# EAGLE schematic PixelPusher-ethernet-extender-shield (EAGLE 7.2.0)
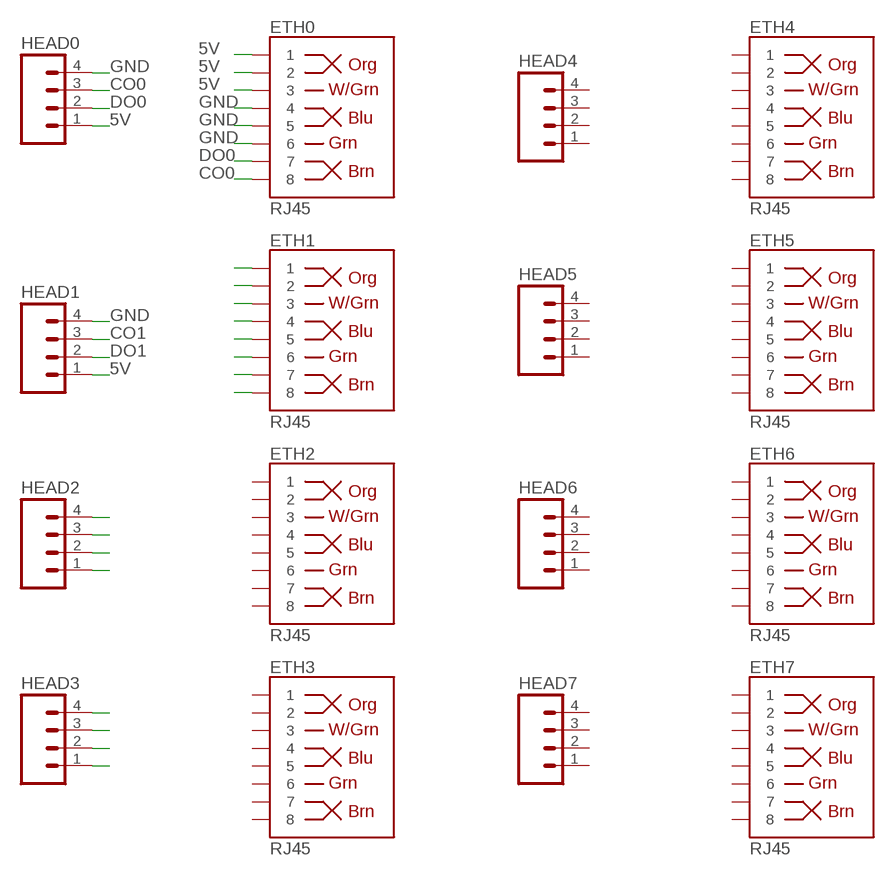
[diagram p0: schematic, sheet 1]

## Parts
ETH0  RJ45  RJ45-8PTH  [RJ45-8]
ETH1  RJ45  RJ45-8PTH  [RJ45-8]
ETH2  RJ45  RJ45-8PTH  [RJ45-8]
ETH3  RJ45  RJ45-8PTH  [RJ45-8]
ETH4  RJ45  RJ45-8PTH  [RJ45-8]
ETH5  RJ45  RJ45-8PTH  [RJ45-8]
ETH6  RJ45  RJ45-8PTH  [RJ45-8]
ETH7  RJ45  RJ45-8PTH  [RJ45-8]
HEAD0  M04JST-PTH-VERT  [JST-4-PTH-VERT]
HEAD1  M04JST-PTH-VERT  [JST-4-PTH-VERT]
HEAD2  M04JST-PTH-VERT  [JST-4-PTH-VERT]
HEAD3  M04JST-PTH-VERT  [JST-4-PTH-VERT]
HEAD4  M04JST-PTH-VERT  [JST-4-PTH-VERT]
HEAD5  M04JST-PTH-VERT  [JST-4-PTH-VERT]
HEAD6  M04JST-PTH-VERT  [JST-4-PTH-VERT]
HEAD7  M04JST-PTH-VERT  [JST-4-PTH-VERT]

## Nets
5V: ETH0.1 ETH0.2 ETH0.3 HEAD0.1 HEAD1.1
CO0: ETH0.8 HEAD0.3
CO1: HEAD1.3
DO0: ETH0.7 HEAD0.2
DO1: HEAD1.2
GND: ETH0.4 ETH0.5 ETH0.6 HEAD0.4 HEAD1.4
N$1: HEAD2.4
N$2: HEAD2.3
N$3: HEAD2.2
N$4: HEAD2.1
N$5: HEAD3.4
N$6: HEAD3.3
N$7: HEAD3.2
N$8: HEAD3.1
N$9: ETH1.1
N$10: ETH1.2
N$11: ETH1.3
N$12: ETH1.4
N$13: ETH1.5
N$14: ETH1.6
N$15: ETH1.7
N$16: ETH1.8
Unconnected: ETH2.1 ETH2.2 ETH2.3 ETH2.4 ETH2.5 ETH2.6 ETH2.7 ETH2.8 ETH3.1 ETH3.2 ETH3.3 ETH3.4 ETH3.5 ETH3.6 ETH3.7 ETH3.8 ETH4.1 ETH4.2 ETH4.3 ETH4.4 ETH4.5 ETH4.6 ETH4.7 ETH4.8 ETH5.1 ETH5.2 ETH5.3 ETH5.4 ETH5.5 ETH5.6 ETH5.7 ETH5.8 ETH6.1 ETH6.2 ETH6.3 ETH6.4 ETH6.5 ETH6.6 ETH6.7 ETH6.8 ETH7.1 ETH7.2 ETH7.3 ETH7.4 ETH7.5 ETH7.6 ETH7.7 ETH7.8 HEAD4.1 HEAD4.2 HEAD4.3 HEAD4.4 HEAD5.1 HEAD5.2 HEAD5.3 HEAD5.4 HEAD6.1 HEAD6.2 HEAD6.3 HEAD6.4 HEAD7.1 HEAD7.2 HEAD7.3 HEAD7.4

## Library data of the parts
ETH0 ETH1-ETH7 = SparkFun-Connectors:RJ45-8: RJ45 Jack Simple RJ45, 8-pin connection - connector for common Cat5, Cat5e, and Cat6 Ethernet cables. Footprint not yet proven in production. Connector sku is PRT-00643; Breakout PCB sku is BOB-00716.; PROD_ID: CONN-08506
HEAD0 HEAD1-HEAD7 = SparkFun-Connectors:M04: Header 4 Standard 4-pin 0.1" header. Use with straight break away headers (SKU : PRT-00116), right angle break away headers (PRT-00553), swiss pins (PRT-00743), machine pins (PRT-00117), and female headers (PRT-00115). Molex polarized connector foot print use with SKU : PRT-08231 with associated crimp pins and housings. 1MM SMD Version SKU: PRT-10208